# Altium schematic sheet wearable.SchDoc
size A; SheetNumber: 1; SheetTotal: 1
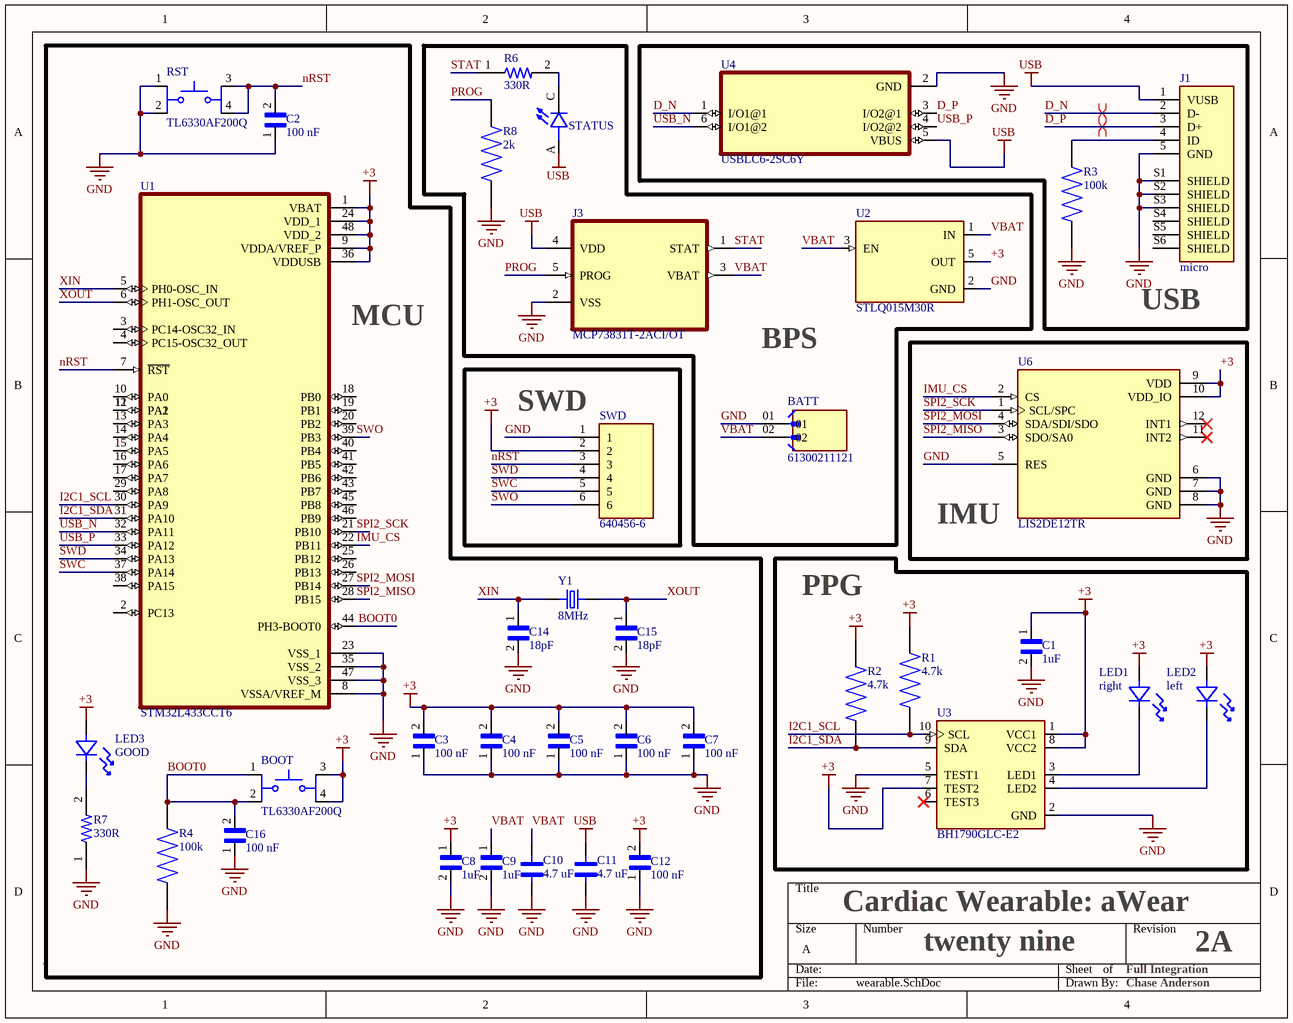
[diagram p0: wearable.SchDoc]

## Parts
?  STATUS  [LED_SML-D12Y1WT86]
BATT  61300211121  [WURTH_61300211121]
BOOT  TL6330AF200Q  [SW_TL6330AF200Q]
C1  1uF  [CAPC1608X90N]
C2  100 nF  [CAPC1608X87N]
C3  100 nF  [CAPC1608X87N]
C4  100 nF  [CAPC1608X87N]
C5  100 nF  [CAPC1608X87N]
C6  100 nF  [CAPC1608X87N]
C7  100 nF  [CAPC1608X87N]
C8  1uF  [CAPC1608X90N]
C9  1uF  [CAPC1608X90N]
C10  4.7 uF  [0603-CAPC1608X9N]
C11  4.7 uF  [0603-CAPC1608X9N]
C12  100 nF  [CAPC1608X87N]
C14  18pF  [CAPC1608X90]
C15  18pF  [CAPC1608X90]
C16  100 nF  [CAPC1608X87N]
J1  micro  [FCI_10118193-0001LF]
J3  MCP73831T-2ACI/OT  [SOT95P280X145-5N]
LED1  right  [LED_CMD17-21VGD_TR8]
LED2  left  [LED_CMD17-21VGD_TR8]
LED3  GOOD  [LED_CMD17-21VGD_TR8]
R1  4.7k  [RES_ERJPA3D4701V]
R2  4.7k  [RES_ERJPA3D4701V]
R3  100k  [RESC1608X55N]
R4  100k  [RESC1608X55N]
R6  330R  [RESC1607X60N]
R7  330R  [RESC1607X60N]
R8  2k  [RES_ERJS03F2001V]
RST  TL6330AF200Q  [SW_TL6330AF200Q]
SWD  640456-6  [TE_640456-6]
U1  STM32L433CCT6  [QFP50P900X900X160-48N]
U2  STLQ015M30R  [SOT23P95_280X145-5N]
U3  BH1790GLC-E2  [PQFN70P280X280X100-10N]
U4  USBLC6-2SC6Y  [SOT95P280X145-6N]
U6  LIS2DE12TR  [QFN50P200X200X100-12N]
Y1  8MHz  [XTAL_ECS-080-18-23G-JGN-TR]

## Blocks framed on the sheet
MCU: BOOT C2-C12 C14-C16 LED3 R4 R7 RST U1 Y1
USB: J1 R3 U4
SWD: SWD
IMU: U6
PPG: C1 LED1 LED2 R1 R2 U3

## Nets
+3: BOOT.3 BOOT.4 C1.1 C3.2 C4.2 C5.2 C6.2 C7.2 C8.1 C12.2 LED1.1 LED2.1 LED3.1 R1.2 R2.2 SWD.2 U1.1(VBAT) U1.9(VDDA/VREF_P) U1.24(VDD_1) U1.36(VDDUSB) U1.48(VDD_2) U2.5(OUT) U3.1(VCC1) U3.7(TEST2) U3.8(VCC2) U6.9(VDD) U6.10(VDD_IO)
GND: BATT.01 C1.2 C2.1 C3.1 C4.1 C5.1 C6.1 C7.1 C8.2 C9.2 C10.1 C11.1 C12.1 C14.2 C15.2 C16.1 J1.5(GND) J1.S1(SHIELD) J1.S2(SHIELD) J1.S3(SHIELD) J3.2(VSS) R3.1 R4.1 R7.1 R8.2 RST.1 RST.2 SWD.1 U1.8(VSSA/VREF_M) U1.23(VSS_1) U1.35(VSS_2) U1.47(VSS_3) U2.2(GND) U3.2(GND) U3.5(TEST1) U4.2(GND) U6.5(RES) U6.6(GND) U6.7(GND) U6.8(GND)
USB: ?.A C11.2 J1.1(VUSB) J3.4(VDD) U4.5(VBUS)
BOOT0: BOOT.1 BOOT.2 C16.2 R4.2 U1.44(PH3-BOOT0)
D_N: J1.2(D-) U4.1(I/O1@1)
D_P: J1.3(D+) U4.3(I/O2@1)
I2C1_SCL: R1.1 U1.30(PA9) U3.10(SCL)
I2C1_SDA: R2.1 U1.31(PA10) U3.9(SDA)
IMU_CS: U1.22(PB11) U6.2(CS)
nRST: C2.2 RST.3 RST.4 SWD.3 U1.7(~{RST})
PROG: J3.5(PROG) R8.1
SPI2_MISO: U1.28(PB15) U6.3(SDO/SA0)
SPI2_MOSI: U1.27(PB14) U6.4(SDA/SDI/SDO)
SPI2_SCK: U1.21(PB10) U6.1(SCL/SPC)
STAT: J3.1(STAT) R6.1
SWC: SWD.5 U1.37(PA14)
SWD: SWD.4 U1.34(PA13)
SWO: SWD.6 U1.39(PB3)
USB_N: U1.32(PA11) U4.6(I/O1@2)
USB_P: U1.33(PA12) U4.4(I/O2@2)
VBAT: BATT.02 C9.1 C10.2 J3.3(VBAT) U2.1(IN) U2.3(EN)
XIN: C14.1 U1.5(PH0-OSC_IN) Y1.1
XOUT: C15.1 U1.6(PH1-OSC_OUT) Y1.2
Net?_C: ?.C R6.2
NetJ1_4: J1.4(ID) R3.2
NetLED1_2: LED1.2 U3.3(LED1)
NetLED2_2: LED2.2 U3.4(LED2)
NetLED3_2: LED3.2 R7.2
NetU1_11: U1.11(PA1) U1.12(PA2)

Not connected (* = marked no-connect by the designer): J1 S4(SHIELD) S5(SHIELD) S6(SHIELD); U1 2(PC13) 3(PC14-OSC32_IN) 4(PC15-OSC32_OUT) 10(PA0) 13(PA3) 14(PA4) 15(PA5) 16(PA6) 17(PA7) 18(PB0) 19(PB1) 20(PB2) 25(PB12) 26(PB13) 29(PA8) 38(PA15) 40(PB4) 41(PB5) 42(PB6) 43(PB7) 45(PB8) 46(PB9); U3 6(TEST3)*; U6 11(INT2)* 12(INT1)*

## Layout directives
differential pair: D_N, D_P

## Notes on the sheet
- (near R8) This board contains three sensitive GPIOs as defined below:
  • PB10
  • PB11
  • PC5
- BPS
- Cardiac Wearable: aWear
- twenty nine
- Full Integration
- 2A
- Chase Anderson

## Library data of the parts
? = SML-D12U1WT86: RED CHIP LED MINI-MOLD; MF: {'manufacturer': u'Rohm'}; Value: *; MP: SML-D12U1WT86; Package: None; Price: None; Availability: Unavailable
BATT = 61300211121: MF: {'manufacturer': u'Wurth Electronics'}; Availability: Unavailable; Package: None; MP: 61300211121; Value: *; Price: None
BOOT RST = TL6330AF200Q: MF: {'manufacturer': u'E-Switch'}; MP: TL6330AF200Q; Package: None; Price: None; Availability: Unavailable; Value: *
C1 C8 C9 = C0603C105K8RACTU: 1.0UF 10V 10% 0603; MF: {'manufacturer': u'KEMET'}; Availability: Unavailable; MP: C0603C105K8RACTU; Price: None; Package: None; Value: *
C2-C7 C12 C16 = MC0603B104J160CT: Product Range:MULTICOMP - MC Series C; ; Product Range:MULTICOMP - MC Series; Capacitance:0.1ÂµF; Capacitance Tolerance:Â± 5%; Dielectric Characteristic:X7R; Voltage Rating:16V; Capacitor Case Style:0603 ^1608 Metric]; Operating Temperature Min:-55Â°C; Packaging:Cut Tape; MF: {'manufacturer': u'Multicomp'}; Package: None; Price: None; Availability: Unavailable; MP: MC0603B104J160CT; Value: *
C10 C11 = CC0603KRX5R6BB475: CAP CER 4.7UF 10V X5R 0603 Â±10%  <p> <a href="https://www.digikey.com/product-detail/en/yageo/CC0603KRX5R6BB475/311-1455-1-ND/2833761">Digikey</a></p> <a href="https://www.yageo.com/upload/media/product/productsearch/datasheet/mlcc/UPY-GPHC_X5R_4V-to-50V_25.pdf">Datasheet</a>; MF: {'manufacturer': u'Yageo'}; Price: None; Value: *; Availability: Unavailable; MP: CC0603KRX5R6BB475; Package: None
C14 C15 = CC0603JRNPO0BN180: Cap Ceramic 18pF 100V C0G 5% Pad SMD 0603 125C T/R; MF: {'manufacturer': u'Yageo'}; Value: *; Price: None; Availability: Unavailable; Package: None; MP: CC0603JRNPO0BN180
J1 = 10118193-0001LF: Micro USB B Type Receptacle; MF: {'manufacturer': u'FCI'}; Package: None; Price: None; Availability: Unavailable; MP: 10118193-0001LF; Value: *
J3 = MCP73831T-2ACI/OT: Charge Management Controller; MP: MCP73831T-2ACI-OT; MF: {'manufacturer': u'Microchip'}; Value: *; Availability: Unavailable; Package: None; Price: None
LED1-LED3 = CMD17-21VGD_TR8: LED, GREEN, 7MCD, 570NM; MP: CMD17-21VGD-TR8; MF: {'manufacturer': u'VCC'}; Availability: Unavailable; Price: None; Package: None; Value: *
R1 R2 = ERJPA3D4701V: MF: {'manufacturer': u'Panasonic'}; Price: None; Value: *; Package: None; Availability: Unavailable; MP: ERJPA3D4701V
R3 R4 = RT0603BRB07100KL: MF: {'manufacturer': u'Yageo'}; Value: *; Availability: Unavailable; Price: None; Package: None; MP: RT0603BRB07100KL
R6 R7 = RC0603FR-07330RL: Resistor: thick film; SMD; 0603; 330Î©; 100mW; Â±1%; -55Ã·155Â°C; MF: {'manufacturer': u'Yageo'}; Price: None; Value: *; Availability: Unavailable; MP: RC0603FR-07330RL; Package: None
R8 = ERJS03F2001V: MF: {'manufacturer': u'Panasonic'}; Value: *; Package: None; Price: None; Availability: Unavailable; MP: ERJS03F2001V
SWD = 640456-6: 220P MTA100 HDR ASSY SQ SPCL; MF: {'manufacturer': u'TE Connectivity'}; Availability: Unavailable; Package: None; MP: 640456-6; Value: *; Price: None
U1 = STM32L433CCT6: MF: {'manufacturer': u'STMicroelectronics'}; MP: STM32L433CCT6; Value: *; Availability: Unavailable; Package: None; Price: None
U2 = STLQ015M30R: 150 mA - ultra low quiescent current linear voltage regulator; MF: {'manufacturer': u'STMicroelectronics'}; Price: None; MP: STLQ015M30R; Availability: Unavailable; Value: *; Package: None
U3 = BH1790GLC-E2: Human Pulse biometric sensor WLGA010V28; MF: {'manufacturer': u'Rohm'}; Price: None; Value: *; Package: None; Availability: Unavailable; MP: BH1790GLC-E2
U4 = USBLC6-2SC6Y: MF: {'manufacturer': u'STMicroelectronics'}; Availability: Unavailable; Package: None; MP: USBLC6-2SC6Y; Value: *; Price: None
U6 = LIS2DE12TR: MEMS digital output motion sensor: ultra low-power high performance 3-axes femto accelerometer; MF: {'manufacturer': u'STMicroelectronics'}; Value: *; MP: LIS2DE12TR; Package: None; Price: None; Availability: Unavailable
Y1 = ECS-080-18-23G-JGN-TR: compact SMD Crystal.; MF: {'manufacturer': u'ECS Inc.'}; Value: *; Price: None; Availability: Unavailable; Package: None; MP: ECS-080-18-23G-JGN-TR